# Altium project LaserLider.PrjPcb (part 2 of 2)
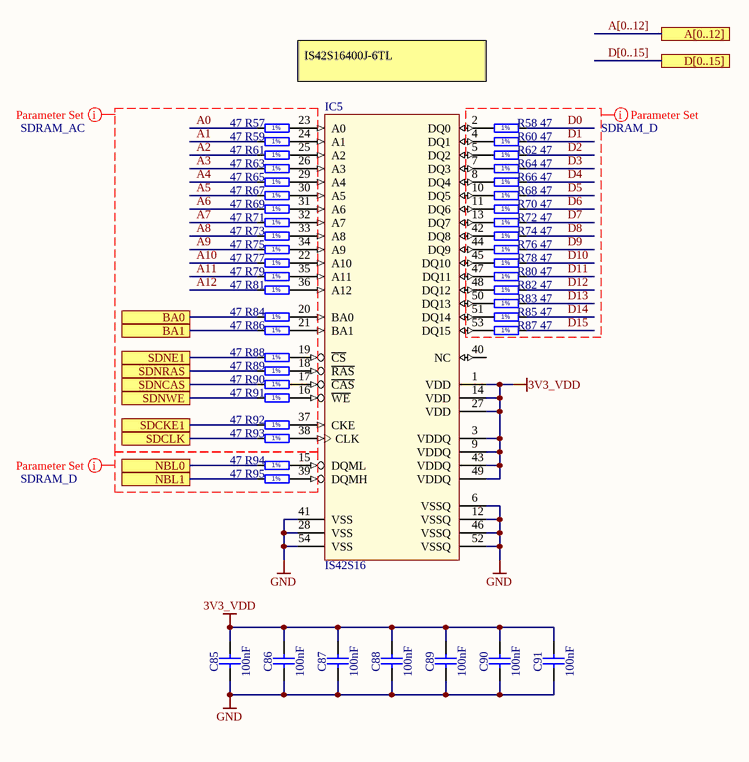
[diagram p4: SDRAM.SchDoc]

## Nets that join several sheets
3V3_VDD: LaserLider (W1.1), MCU (21 pins), VCSEL (8 pins), SDRAM (14 pins)
GND: LaserLider (J8.5 W1.3), MCU (25 pins), VCSEL (32 pins), SDRAM (14 pins)
ADC_TC: MCU (U10.15), VCSEL (C96.2 R102.2 VCSEL1.4)
DAC_OUT: MCU (U10.28), VCSEL (IC6.6)
DDS_DATA: MCU (U10.44), VCSEL (U11.6)
DDS_FSYNC: MCU (U10.41), VCSEL (U11.8)
DDS_SCLK: MCU (U10.42), VCSEL (U11.7)
EXTI0: LaserLider (J8.4 R53.2), MCU (U10.81)
EXTI1: LaserLider (J8.3 R54.2), MCU (U10.82)
EXTI2: LaserLider (J8.2 R109.2), MCU (U10.83)
EXTI3: LaserLider (J8.1 R110.2), MCU (U10.84)
NRST: LaserLider (W1.5), MCU (U10.14)
SIG_SEL: MCU (U10.95), VCSEL (IC6.1)
SWCLK: LaserLider (W1.2), MCU (U10.76)
SWDIO: LaserLider (W1.4), MCU (U10.72)
TIM1_ETR: LaserLider (R53.1), MCU (U10.37)
TIM2_ETR: LaserLider (R54.1), MCU (U10.77)
TIM4_ETR: LaserLider (R109.1), MCU (U10.97)
TIM8_ETR: LaserLider (R110.1), MCU (U10.22)